# Altium schematic sheet Output.SchDoc
size A2; SPICEModelCacheAEWMZWDM: <root> / <DocumentId>AEWMZWDM</DocumentId> / </root>; SheetNumber: 8; SheetTotal: 9
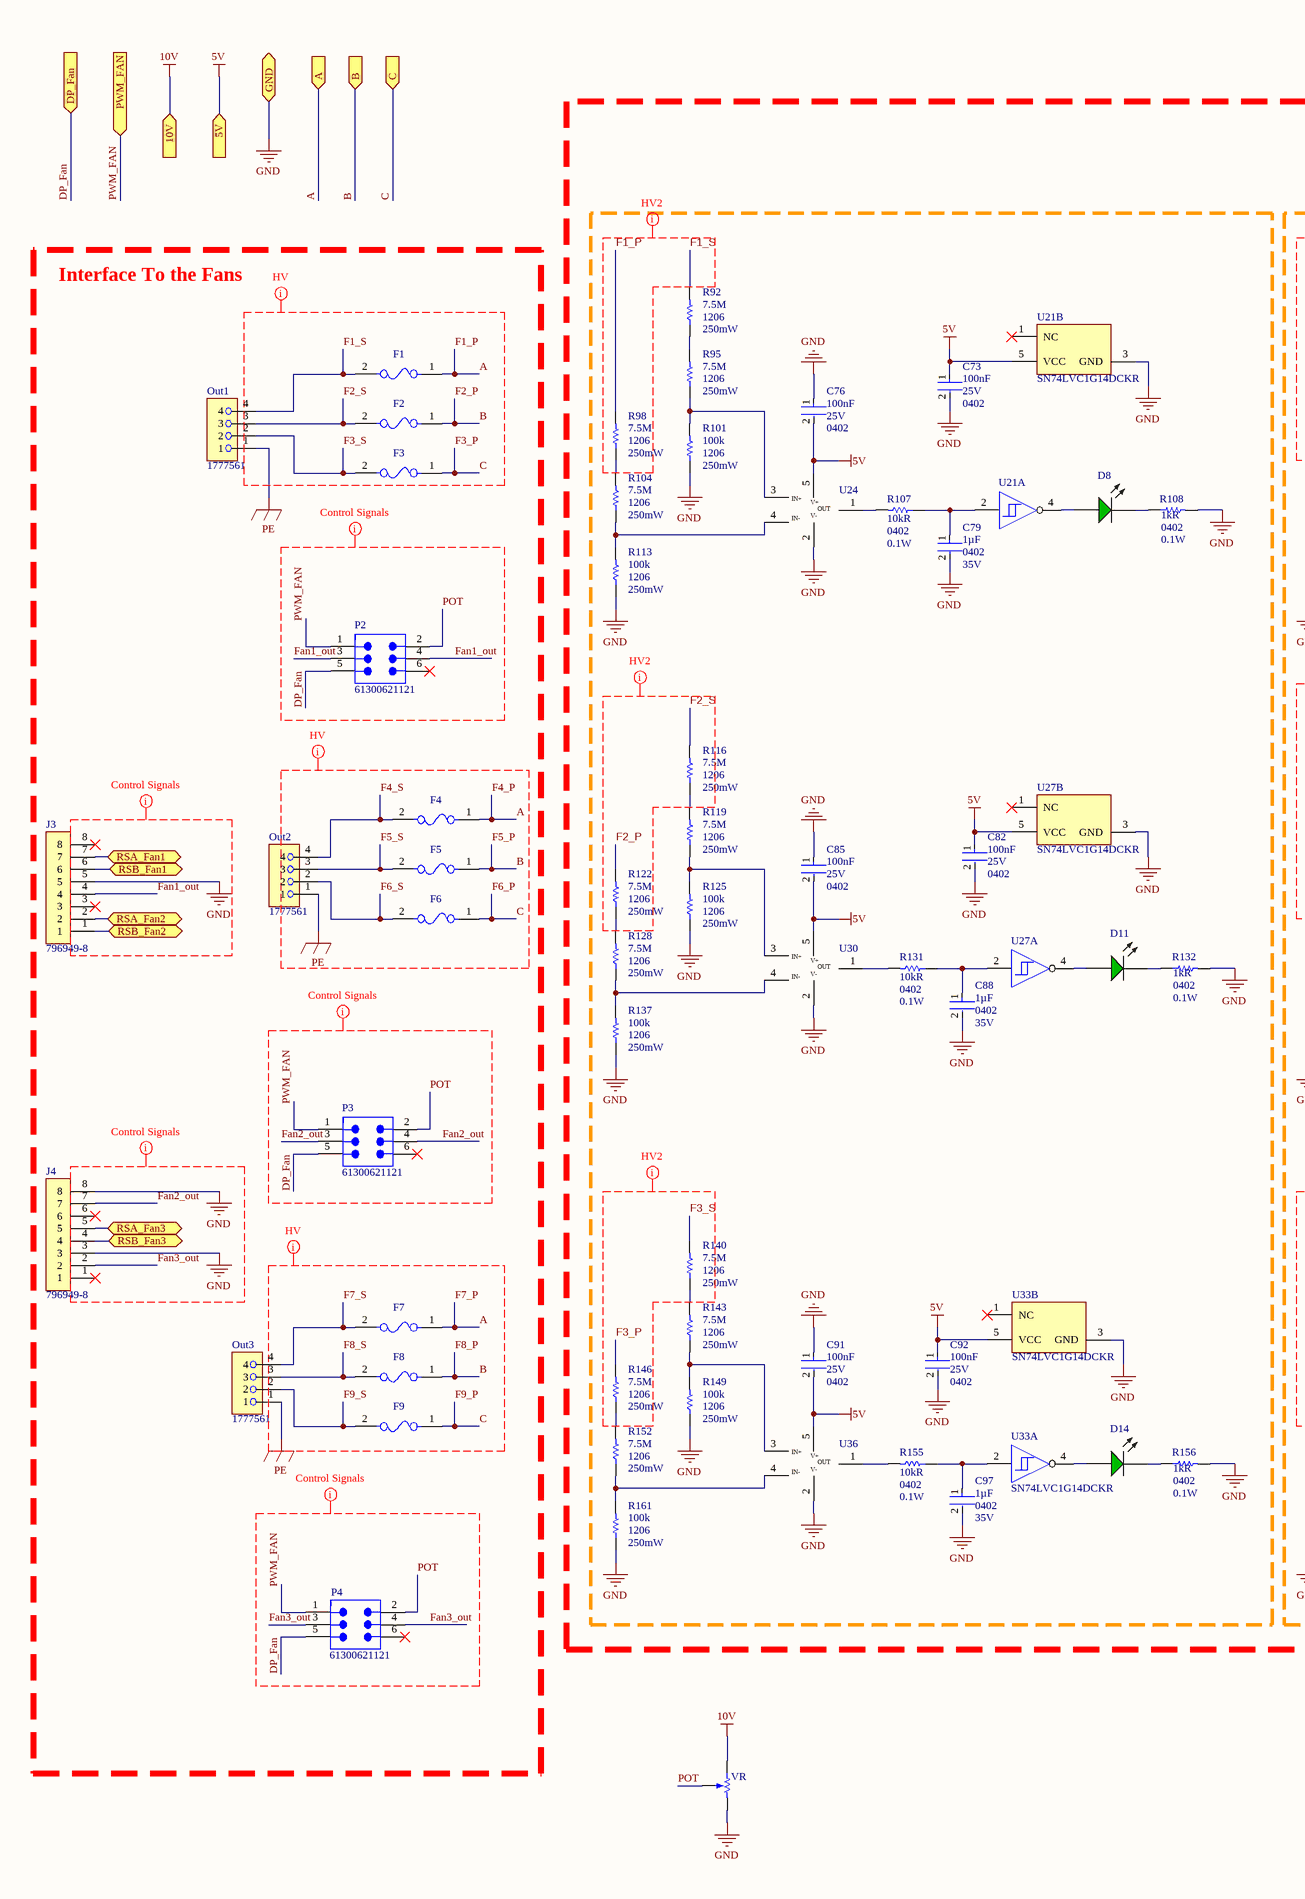
[diagram p0: Output.SchDoc, left]
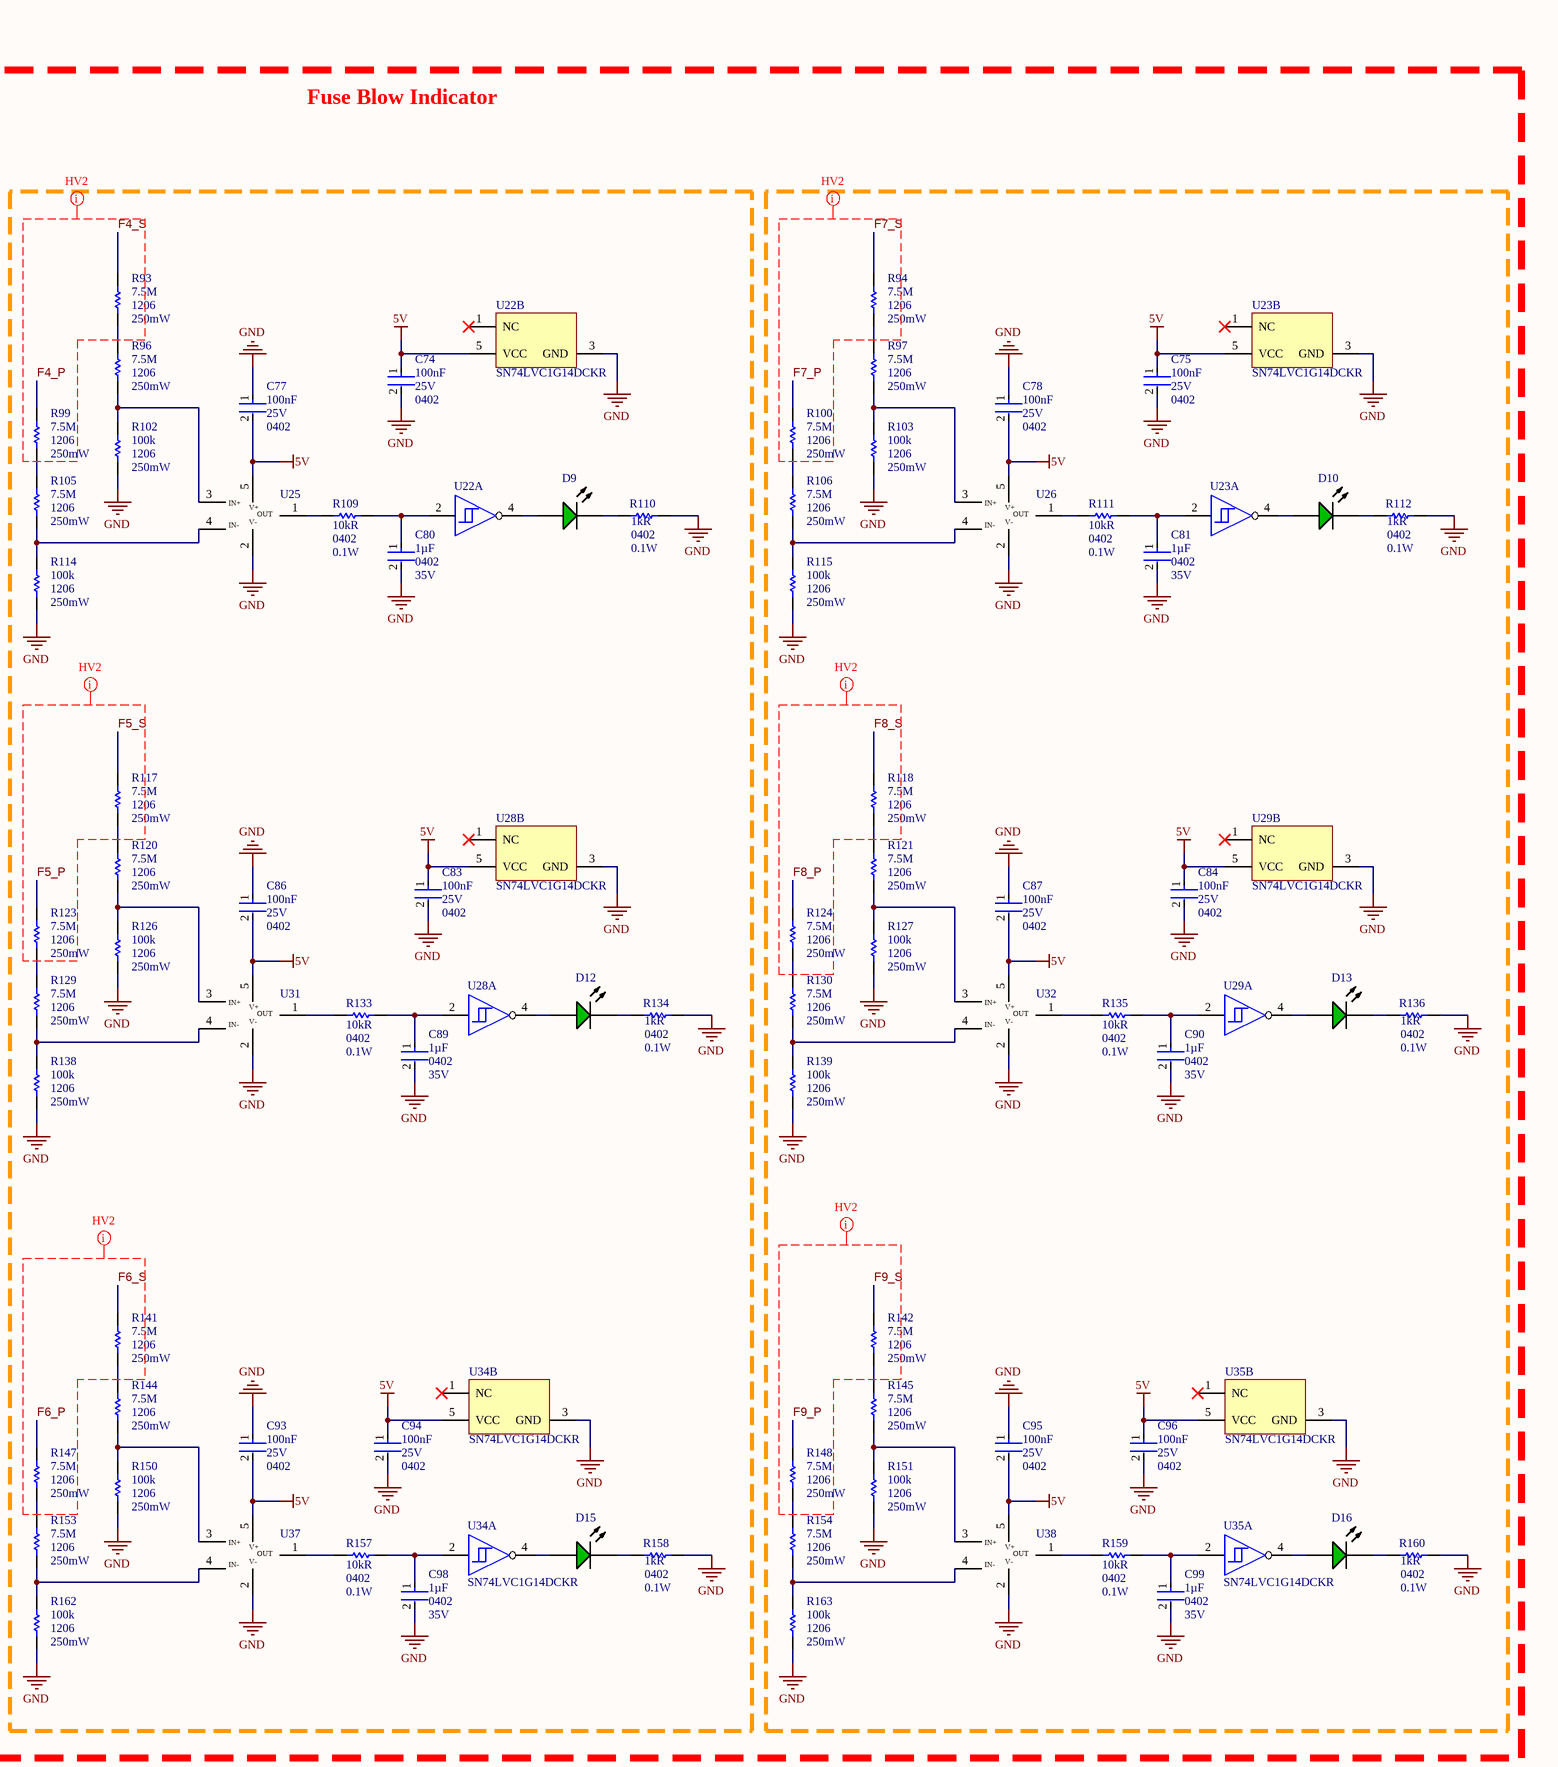
[diagram p1: Output.SchDoc, right]

## Parts
C73  value 100nF  Voltage Rating: 25V  Case/Package: 0402  [FP-CL830-IPC_A]  (hidden comment: CL05B104KA5NNNC)
C74  value 100nF  Voltage Rating: 25V  Case/Package: 0402  [FP-CL830-IPC_A]  (hidden comment: CL05B104KA5NNNC)
C75  value 100nF  Voltage Rating: 25V  Case/Package: 0402  [FP-CL830-IPC_A]  (hidden comment: CL05B104KA5NNNC)
C76  value 100nF  Voltage Rating: 25V  Case/Package: 0402  [FP-CL830-IPC_A]  (hidden comment: CL05B104KA5NNNC)
C77  value 100nF  Voltage Rating: 25V  Case/Package: 0402  [FP-CL830-IPC_A]  (hidden comment: CL05B104KA5NNNC)
C78  value 100nF  Voltage Rating: 25V  Case/Package: 0402  [FP-CL830-IPC_A]  (hidden comment: CL05B104KA5NNNC)
C79  value 1µF  Case/Package: 0402  Voltage Rating: 35V  [FP-C1005-050-0_05-IPC_A]  (hidden comment: C1005JB1V105K050BC)
C80  value 1µF  Case/Package: 0402  Voltage Rating: 35V  [FP-C1005-050-0_05-IPC_A]  (hidden comment: C1005JB1V105K050BC)
C81  value 1µF  Case/Package: 0402  Voltage Rating: 35V  [FP-C1005-050-0_05-IPC_A]  (hidden comment: C1005JB1V105K050BC)
C82  value 100nF  Voltage Rating: 25V  Case/Package: 0402  [FP-CL830-IPC_A]  (hidden comment: CL05B104KA5NNNC)
C83  value 100nF  Voltage Rating: 25V  Case/Package: 0402  [FP-CL830-IPC_A]  (hidden comment: CL05B104KA5NNNC)
C84  value 100nF  Voltage Rating: 25V  Case/Package: 0402  [FP-CL830-IPC_A]  (hidden comment: CL05B104KA5NNNC)
C85  value 100nF  Voltage Rating: 25V  Case/Package: 0402  [FP-CL830-IPC_A]  (hidden comment: CL05B104KA5NNNC)
C86  value 100nF  Voltage Rating: 25V  Case/Package: 0402  [FP-CL830-IPC_A]  (hidden comment: CL05B104KA5NNNC)
C87  value 100nF  Voltage Rating: 25V  Case/Package: 0402  [FP-CL830-IPC_A]  (hidden comment: CL05B104KA5NNNC)
C88  value 1µF  Case/Package: 0402  Voltage Rating: 35V  [FP-C1005-050-0_05-IPC_A]  (hidden comment: C1005JB1V105K050BC)
C89  value 1µF  Case/Package: 0402  Voltage Rating: 35V  [FP-C1005-050-0_05-IPC_A]  (hidden comment: C1005JB1V105K050BC)
C90  value 1µF  Case/Package: 0402  Voltage Rating: 35V  [FP-C1005-050-0_05-IPC_A]  (hidden comment: C1005JB1V105K050BC)
C91  value 100nF  Voltage Rating: 25V  Case/Package: 0402  [FP-CL830-IPC_A]  (hidden comment: CL05B104KA5NNNC)
C92  value 100nF  Voltage Rating: 25V  Case/Package: 0402  [FP-CL830-IPC_A]  (hidden comment: CL05B104KA5NNNC)
C93  value 100nF  Voltage Rating: 25V  Case/Package: 0402  [FP-CL830-IPC_A]  (hidden comment: CL05B104KA5NNNC)
C94  value 100nF  Voltage Rating: 25V  Case/Package: 0402  [FP-CL830-IPC_A]  (hidden comment: CL05B104KA5NNNC)
C95  value 100nF  Voltage Rating: 25V  Case/Package: 0402  [FP-CL830-IPC_A]  (hidden comment: CL05B104KA5NNNC)
C96  value 100nF  Voltage Rating: 25V  Case/Package: 0402  [FP-CL830-IPC_A]  (hidden comment: CL05B104KA5NNNC)
C97  value 1µF  Case/Package: 0402  Voltage Rating: 35V  [FP-C1005-050-0_05-IPC_A]  (hidden comment: C1005JB1V105K050BC)
C98  value 1µF  Case/Package: 0402  Voltage Rating: 35V  [FP-C1005-050-0_05-IPC_A]  (hidden comment: C1005JB1V105K050BC)
C99  value 1µF  Case/Package: 0402  Voltage Rating: 35V  [FP-C1005-050-0_05-IPC_A]  (hidden comment: C1005JB1V105K050BC)
D8  599-0480-127F  [QTLP650D4TR-Footprint-1]  (value not drawn)
D9  599-0480-127F  [QTLP650D4TR-Footprint-1]  (value not drawn)
D10  599-0480-127F  [QTLP650D4TR-Footprint-1]  (value not drawn)
D11  599-0480-127F  [QTLP650D4TR-Footprint-1]  (value not drawn)
D12  599-0480-127F  [QTLP650D4TR-Footprint-1]  (value not drawn)
D13  599-0480-127F  [QTLP650D4TR-Footprint-1]  (value not drawn)
D14  599-0480-127F  [QTLP650D4TR-Footprint-1]  (value not drawn)
D15  599-0480-127F  [QTLP650D4TR-Footprint-1]  (value not drawn)
D16  599-0480-127F  [QTLP650D4TR-Footprint-1]  (value not drawn)
F1  01220088ZR  [New footprint 1]  (value not drawn)
F2  01220088ZR  [New footprint 1]  (value not drawn)
F3  01220088ZR  [New footprint 1]  (value not drawn)
F4  01220088ZR  [New footprint 1]  (value not drawn)
F5  01220088ZR  [New footprint 1]  (value not drawn)
F6  01220088ZR  [New footprint 1]  (value not drawn)
F7  01220088ZR  [New footprint 1]  (value not drawn)
F8  01220088ZR  [New footprint 1]  (value not drawn)
F9  01220088ZR  [New footprint 1]  (value not drawn)
J3  796949-8  [796949-8-Footprint-1]
J4  796949-8  [796949-8-Footprint-1]
Out1  1777561  [1777561-Footprint-1]
Out2  1777561  [1777561-Footprint-1]
Out3  1777561  [1777561-Footprint-1]
P2  61300621121  [61300621121]
P3  61300621121  [61300621121]
P4  61300621121  [61300621121]
R92  value 7.5M  Case/Package: 1206  Power: 250mW  [FP-KTR18-IPC_A]  (hidden comment: KTR18EZPF7504)
R93  value 7.5M  Case/Package: 1206  Power: 250mW  [FP-KTR18-IPC_A]  (hidden comment: KTR18EZPF7504)
R94  value 7.5M  Case/Package: 1206  Power: 250mW  [FP-KTR18-IPC_A]  (hidden comment: KTR18EZPF7504)
R95  value 7.5M  Case/Package: 1206  Power: 250mW  [FP-KTR18-IPC_A]  (hidden comment: KTR18EZPF7504)
R96  value 7.5M  Case/Package: 1206  Power: 250mW  [FP-KTR18-IPC_A]  (hidden comment: KTR18EZPF7504)
R97  value 7.5M  Case/Package: 1206  Power: 250mW  [FP-KTR18-IPC_A]  (hidden comment: KTR18EZPF7504)
R98  value 7.5M  Case/Package: 1206  Power: 250mW  [FP-KTR18-IPC_A]  (hidden comment: KTR18EZPF7504)
R99  value 7.5M  Case/Package: 1206  Power: 250mW  [FP-KTR18-IPC_A]  (hidden comment: KTR18EZPF7504)
R100  value 7.5M  Case/Package: 1206  Power: 250mW  [FP-KTR18-IPC_A]  (hidden comment: KTR18EZPF7504)
R101  value 100k  Case/Package: 1206  Power: 250mW  [RESC3216X70X40NL20T20]  (hidden comment: RK73H2BTTD1003F)
R102  value 100k  Case/Package: 1206  Power: 250mW  [RESC3216X70X40NL20T20]  (hidden comment: RK73H2BTTD1003F)
R103  value 100k  Case/Package: 1206  Power: 250mW  [RESC3216X70X40NL20T20]  (hidden comment: RK73H2BTTD1003F)
R104  value 7.5M  Case/Package: 1206  Power: 250mW  [FP-KTR18-IPC_A]  (hidden comment: KTR18EZPF7504)
R105  value 7.5M  Case/Package: 1206  Power: 250mW  [FP-KTR18-IPC_A]  (hidden comment: KTR18EZPF7504)
R106  value 7.5M  Case/Package: 1206  Power: 250mW  [FP-KTR18-IPC_A]  (hidden comment: KTR18EZPF7504)
R107  value 10kR  Package: 0402  Power: 0.1W  [RESC1005X40X25LL10T10]  (hidden comment: RK73H1ETTP1002F)
R108  value 1kR  Package: 0402  Power: 0.1W  [RESC1005X40X25LL10T10]  (hidden comment: RK73H1ETTP1001F)
R109  value 10kR  Package: 0402  Power: 0.1W  [RESC1005X40X25LL10T10]  (hidden comment: RK73H1ETTP1002F)
R110  value 1kR  Package: 0402  Power: 0.1W  [RESC1005X40X25LL10T10]  (hidden comment: RK73H1ETTP1001F)
R111  value 10kR  Package: 0402  Power: 0.1W  [RESC1005X40X25LL10T10]  (hidden comment: RK73H1ETTP1002F)
R112  value 1kR  Package: 0402  Power: 0.1W  [RESC1005X40X25LL10T10]  (hidden comment: RK73H1ETTP1001F)
R113  value 100k  Case/Package: 1206  Power: 250mW  [RESC3216X70X40NL20T20]  (hidden comment: RK73H2BTTD1003F)
R114  value 100k  Case/Package: 1206  Power: 250mW  [RESC3216X70X40NL20T20]  (hidden comment: RK73H2BTTD1003F)
R115  value 100k  Case/Package: 1206  Power: 250mW  [RESC3216X70X40NL20T20]  (hidden comment: RK73H2BTTD1003F)
R116  value 7.5M  Case/Package: 1206  Power: 250mW  [FP-KTR18-IPC_A]  (hidden comment: KTR18EZPF7504)
R117  value 7.5M  Case/Package: 1206  Power: 250mW  [FP-KTR18-IPC_A]  (hidden comment: KTR18EZPF7504)
R118  value 7.5M  Case/Package: 1206  Power: 250mW  [FP-KTR18-IPC_A]  (hidden comment: KTR18EZPF7504)
R119  value 7.5M  Case/Package: 1206  Power: 250mW  [FP-KTR18-IPC_A]  (hidden comment: KTR18EZPF7504)
R120  value 7.5M  Case/Package: 1206  Power: 250mW  [FP-KTR18-IPC_A]  (hidden comment: KTR18EZPF7504)
R121  value 7.5M  Case/Package: 1206  Power: 250mW  [FP-KTR18-IPC_A]  (hidden comment: KTR18EZPF7504)
R122  value 7.5M  Case/Package: 1206  Power: 250mW  [FP-KTR18-IPC_A]  (hidden comment: KTR18EZPF7504)
R123  value 7.5M  Case/Package: 1206  Power: 250mW  [FP-KTR18-IPC_A]  (hidden comment: KTR18EZPF7504)
R124  value 7.5M  Case/Package: 1206  Power: 250mW  [FP-KTR18-IPC_A]  (hidden comment: KTR18EZPF7504)
R125  value 100k  Case/Package: 1206  Power: 250mW  [RESC3216X70X40NL20T20]  (hidden comment: RK73H2BTTD1003F)
R126  value 100k  Case/Package: 1206  Power: 250mW  [RESC3216X70X40NL20T20]  (hidden comment: RK73H2BTTD1003F)
R127  value 100k  Case/Package: 1206  Power: 250mW  [RESC3216X70X40NL20T20]  (hidden comment: RK73H2BTTD1003F)
R128  value 7.5M  Case/Package: 1206  Power: 250mW  [FP-KTR18-IPC_A]  (hidden comment: KTR18EZPF7504)
R129  value 7.5M  Case/Package: 1206  Power: 250mW  [FP-KTR18-IPC_A]  (hidden comment: KTR18EZPF7504)
R130  value 7.5M  Case/Package: 1206  Power: 250mW  [FP-KTR18-IPC_A]  (hidden comment: KTR18EZPF7504)
R131  value 10kR  Package: 0402  Power: 0.1W  [RESC1005X40X25LL10T10]  (hidden comment: RK73H1ETTP1002F)
R132  value 1kR  Package: 0402  Power: 0.1W  [RESC1005X40X25LL10T10]  (hidden comment: RK73H1ETTP1001F)
R133  value 10kR  Package: 0402  Power: 0.1W  [RESC1005X40X25LL10T10]  (hidden comment: RK73H1ETTP1002F)
R134  value 1kR  Package: 0402  Power: 0.1W  [RESC1005X40X25LL10T10]  (hidden comment: RK73H1ETTP1001F)
R135  value 10kR  Package: 0402  Power: 0.1W  [RESC1005X40X25LL10T10]  (hidden comment: RK73H1ETTP1002F)
R136  value 1kR  Package: 0402  Power: 0.1W  [RESC1005X40X25LL10T10]  (hidden comment: RK73H1ETTP1001F)
R137  value 100k  Case/Package: 1206  Power: 250mW  [RESC3216X70X40NL20T20]  (hidden comment: RK73H2BTTD1003F)
R138  value 100k  Case/Package: 1206  Power: 250mW  [RESC3216X70X40NL20T20]  (hidden comment: RK73H2BTTD1003F)
R139  value 100k  Case/Package: 1206  Power: 250mW  [RESC3216X70X40NL20T20]  (hidden comment: RK73H2BTTD1003F)
R140  value 7.5M  Case/Package: 1206  Power: 250mW  [FP-KTR18-IPC_A]  (hidden comment: KTR18EZPF7504)
R141  value 7.5M  Case/Package: 1206  Power: 250mW  [FP-KTR18-IPC_A]  (hidden comment: KTR18EZPF7504)
R142  value 7.5M  Case/Package: 1206  Power: 250mW  [FP-KTR18-IPC_A]  (hidden comment: KTR18EZPF7504)
R143  value 7.5M  Case/Package: 1206  Power: 250mW  [FP-KTR18-IPC_A]  (hidden comment: KTR18EZPF7504)
R144  value 7.5M  Case/Package: 1206  Power: 250mW  [FP-KTR18-IPC_A]  (hidden comment: KTR18EZPF7504)
R145  value 7.5M  Case/Package: 1206  Power: 250mW  [FP-KTR18-IPC_A]  (hidden comment: KTR18EZPF7504)
R146  value 7.5M  Case/Package: 1206  Power: 250mW  [FP-KTR18-IPC_A]  (hidden comment: KTR18EZPF7504)
R147  value 7.5M  Case/Package: 1206  Power: 250mW  [FP-KTR18-IPC_A]  (hidden comment: KTR18EZPF7504)
R148  value 7.5M  Case/Package: 1206  Power: 250mW  [FP-KTR18-IPC_A]  (hidden comment: KTR18EZPF7504)
R149  value 100k  Case/Package: 1206  Power: 250mW  [RESC3216X70X40NL20T20]  (hidden comment: RK73H2BTTD1003F)
R150  value 100k  Case/Package: 1206  Power: 250mW  [RESC3216X70X40NL20T20]  (hidden comment: RK73H2BTTD1003F)
R151  value 100k  Case/Package: 1206  Power: 250mW  [RESC3216X70X40NL20T20]  (hidden comment: RK73H2BTTD1003F)
R152  value 7.5M  Case/Package: 1206  Power: 250mW  [FP-KTR18-IPC_A]  (hidden comment: KTR18EZPF7504)
R153  value 7.5M  Case/Package: 1206  Power: 250mW  [FP-KTR18-IPC_A]  (hidden comment: KTR18EZPF7504)
R154  value 7.5M  Case/Package: 1206  Power: 250mW  [FP-KTR18-IPC_A]  (hidden comment: KTR18EZPF7504)
R155  value 10kR  Package: 0402  Power: 0.1W  [RESC1005X40X25LL10T10]  (hidden comment: RK73H1ETTP1002F)
R156  value 1kR  Package: 0402  Power: 0.1W  [RESC1005X40X25LL10T10]  (hidden comment: RK73H1ETTP1001F)
R157  value 10kR  Package: 0402  Power: 0.1W  [RESC1005X40X25LL10T10]  (hidden comment: RK73H1ETTP1002F)
R158  value 1kR  Package: 0402  Power: 0.1W  [RESC1005X40X25LL10T10]  (hidden comment: RK73H1ETTP1001F)
R159  value 10kR  Package: 0402  Power: 0.1W  [RESC1005X40X25LL10T10]  (hidden comment: RK73H1ETTP1002F)
R160  value 1kR  Package: 0402  Power: 0.1W  [RESC1005X40X25LL10T10]  (hidden comment: RK73H1ETTP1001F)
R161  value 100k  Case/Package: 1206  Power: 250mW  [RESC3216X70X40NL20T20]  (hidden comment: RK73H2BTTD1003F)
R162  value 100k  Case/Package: 1206  Power: 250mW  [RESC3216X70X40NL20T20]  (hidden comment: RK73H2BTTD1003F)
R163  value 100k  Case/Package: 1206  Power: 250mW  [RESC3216X70X40NL20T20]  (hidden comment: RK73H2BTTD1003F)
U21  SN74LVC1G14DCKR  [DCK0005A_N]  (value not drawn)  (parts A,B of 2)
U22  SN74LVC1G14DCKR  [DCK0005A_N]  (value not drawn)  (parts A,B of 2)
U23  SN74LVC1G14DCKR  [DCK0005A_N]  (value not drawn)  (parts A,B of 2)
U24  TLV6001UIDBVR  [TLV6001UIDBVR-Footprint-1]  (value not drawn)
U25  TLV6001UIDBVR  [TLV6001UIDBVR-Footprint-1]  (value not drawn)
U26  TLV6001UIDBVR  [TLV6001UIDBVR-Footprint-1]  (value not drawn)
U27  SN74LVC1G14DCKR  [DCK0005A_N]  (value not drawn)  (parts A,B of 2)
U28  SN74LVC1G14DCKR  [DCK0005A_N]  (value not drawn)  (parts A,B of 2)
U29  SN74LVC1G14DCKR  [DCK0005A_N]  (value not drawn)  (parts A,B of 2)
U30  TLV6001UIDBVR  [TLV6001UIDBVR-Footprint-1]  (value not drawn)
U31  TLV6001UIDBVR  [TLV6001UIDBVR-Footprint-1]  (value not drawn)
U32  TLV6001UIDBVR  [TLV6001UIDBVR-Footprint-1]  (value not drawn)
U33  SN74LVC1G14DCKR  [DCK0005A_N]  (parts A,B of 2)
U34  SN74LVC1G14DCKR  [DCK0005A_N]  (parts A,B of 2)
U35  SN74LVC1G14DCKR  [DCK0005A_N]  (parts A,B of 2)
U36  TLV6001UIDBVR  [TLV6001UIDBVR-Footprint-1]  (value not drawn)
U37  TLV6001UIDBVR  [TLV6001UIDBVR-Footprint-1]  (value not drawn)
U38  TLV6001UIDBVR  [TLV6001UIDBVR-Footprint-1]  (value not drawn)
VR  PC16SV-10IP06-103A2020-TA  [PC16SV-10IP06-103A2020-TA-Footprint-1]  (value not drawn)

## Blocks framed on the sheet
Fuse Blow Indicator: C73-C99 D8-D16 R92-R163 U21-U38
Interface To the Fans: F1-F9 J3 J4 Out1-Out3 P2-P4

## Ports
5V (in), 10V (in), A (in), B (in), C (in), DP_Fan (in), GND (bidir), PWM_FAN (in), RSA_Fan1 (bidir), RSA_Fan2 (bidir), RSA_Fan3 (bidir), RSB_Fan1 (bidir), RSB_Fan2 (bidir), RSB_Fan3 (bidir)

## Nets
5V: C73.1 C74.1 C75.1 C76.2 C77.2 C78.2 C82.1 C83.1 C84.1 C85.2 C86.2 C87.2 C91.2 C92.1 C93.2 C94.1 C95.2 C96.1 U21.5(VCC) U22.5(VCC) U23.5(VCC) U24.5(V+) U25.5(V+) U26.5(V+) U27.5(VCC) U28.5(VCC) U29.5(VCC) U30.5(V+) U31.5(V+) U32.5(V+) U33.5(VCC) U34.5(VCC) U35.5(VCC) U36.5(V+) U37.5(V+) U38.5(V+) ; port 5V
10V: VR.1 ; port 10V
GND: C73.2 C74.2 C75.2 C76.1 C77.1 C78.1 C79.2 C80.2 C81.2 C82.2 C83.2 C84.2 C85.1 C86.1 C87.1 C88.2 C89.2 C90.2 C91.1 C92.2 C93.1 C94.2 C95.1 C96.2 C97.2 C98.2 C99.2 J3.5 J4.3 J4.8 R101.1 R102.1 R103.1 R108.2 R110.2 R112.2 R113.1 R114.1 R115.1 R125.1 R126.1 R127.1 R132.2 R134.2 R136.2 R137.1 R138.1 R139.1 R149.1 R150.1 R151.1 R156.2 R158.2 R160.2 R161.1 R162.1 R163.1 U21.3(GND) U22.3(GND) U23.3(GND) U24.2(V-) U25.2(V-) U26.2(V-) U27.3(GND) U28.3(GND) U29.3(GND) U30.2(V-) U31.2(V-) U32.2(V-) U33.3(GND) U34.3(GND) U35.3(GND) U36.2(V-) U37.2(V-) U38.2(V-) VR.3 ; port GND
PE: Out1.1 Out2.1 Out3.1
A: F1.1 F4.1 F7.1 R98.2 R99.2 R100.2 ; port A  [also labelled F1_P, F4_P, F7_P]
B: F2.1 F5.1 F8.1 R122.2 R123.2 R124.2 ; port B  [also labelled F2_P, F5_P, F8_P]
C: F3.1 F6.1 F9.1 R146.2 R147.2 R148.2 ; port C  [also labelled F3_P, F6_P, F9_P]
DP_Fan: P2.5 P3.5 P4.5 ; port DP_Fan
F1_S: F1.2 Out1.4 R92.2
F2_S: F2.2 Out1.3 R116.2
F3_S: F3.2 Out1.2 R140.2
F4_S: F4.2 Out2.4 R93.2
F5_S: F5.2 Out2.3 R117.2
F6_S: F6.2 Out2.2 R141.2
F7_S: F7.2 Out3.4 R94.2
F8_S: F8.2 Out3.3 R118.2
F9_S: F9.2 Out3.2 R142.2
Fan1_out: J3.4 P2.3 P2.4
Fan2_out: J4.7 P3.3 P3.4
Fan3_out: J4.2 P4.3 P4.4
POT: P2.2 P3.2 P4.2 VR.2
PWM_FAN: P2.1 P3.1 P4.1 ; port PWM_FAN
RSA_Fan1: J3.7 ; port RSA_Fan1
RSA_Fan2: J3.2 ; port RSA_Fan2
RSA_Fan3: J4.5 ; port RSA_Fan3
RSB_Fan1: J3.6 ; port RSB_Fan1
RSB_Fan2: J3.1 ; port RSB_Fan2
RSB_Fan3: J4.4 ; port RSB_Fan3
NetC79_1: C79.1 R107.1 U21.2(A)
NetC80_1: C80.1 R109.1 U22.2(A)
NetC81_1: C81.1 R111.1 U23.2(A)
NetC88_1: C88.1 R131.1 U27.2(A)
NetC89_1: C89.1 R133.1 U28.2(A)
NetC90_1: C90.1 R135.1 U29.2(A)
NetC97_1: C97.1 R155.1 U33.2(A)
NetC98_1: C98.1 R157.1 U34.2(A)
NetC99_1: C99.1 R159.1 U35.2(A)
NetD8_1: D8.1(A) U21.4(Y)
NetD8_2: D8.2(K) R108.1
NetD9_1: D9.1(A) U22.4(Y)
NetD9_2: D9.2(K) R110.1
NetD10_1: D10.1(A) U23.4(Y)
NetD10_2: D10.2(K) R112.1
NetD11_1: D11.1(A) U27.4(Y)
NetD11_2: D11.2(K) R132.1
NetD12_1: D12.1(A) U28.4(Y)
NetD12_2: D12.2(K) R134.1
NetD13_1: D13.1(A) U29.4(Y)
NetD13_2: D13.2(K) R136.1
NetD14_1: D14.1(A) U33.4(Y)
NetD14_2: D14.2(K) R156.1
NetD15_1: D15.1(A) U34.4(Y)
NetD15_2: D15.2(K) R158.1
NetD16_1: D16.1(A) U35.4(Y)
NetD16_2: D16.2(K) R160.1
NetR92_1: R92.1 R95.2
NetR93_1: R93.1 R96.2
NetR94_1: R94.1 R97.2
NetR95_1: R95.1 R101.2 U24.3(+IN)
NetR96_1: R96.1 R102.2 U25.3(+IN)
NetR97_1: R97.1 R103.2 U26.3(+IN)
NetR98_1: R98.1 R104.2
NetR99_1: R99.1 R105.2
NetR100_1: R100.1 R106.2
NetR104_1: R104.1 R113.2 U24.4(-IN)
NetR105_1: R105.1 R114.2 U25.4(-IN)
NetR106_1: R106.1 R115.2 U26.4(-IN)
NetR107_2: R107.2 U24.1(OUT)
NetR109_2: R109.2 U25.1(OUT)
NetR111_2: R111.2 U26.1(OUT)
NetR116_1: R116.1 R119.2
NetR117_1: R117.1 R120.2
NetR118_1: R118.1 R121.2
NetR119_1: R119.1 R125.2 U30.3(+IN)
NetR120_1: R120.1 R126.2 U31.3(+IN)
NetR121_1: R121.1 R127.2 U32.3(+IN)
NetR122_1: R122.1 R128.2
NetR123_1: R123.1 R129.2
NetR124_1: R124.1 R130.2
NetR128_1: R128.1 R137.2 U30.4(-IN)
NetR129_1: R129.1 R138.2 U31.4(-IN)
NetR130_1: R130.1 R139.2 U32.4(-IN)
NetR131_2: R131.2 U30.1(OUT)
NetR133_2: R133.2 U31.1(OUT)
NetR135_2: R135.2 U32.1(OUT)
NetR140_1: R140.1 R143.2
NetR141_1: R141.1 R144.2
NetR142_1: R142.1 R145.2
NetR143_1: R143.1 R149.2 U36.3(+IN)
NetR144_1: R144.1 R150.2 U37.3(+IN)
NetR145_1: R145.1 R151.2 U38.3(+IN)
NetR146_1: R146.1 R152.2
NetR147_1: R147.1 R153.2
NetR148_1: R148.1 R154.2
NetR152_1: R152.1 R161.2 U36.4(-IN)
NetR153_1: R153.1 R162.2 U37.4(-IN)
NetR154_1: R154.1 R163.2 U38.4(-IN)
NetR155_2: R155.2 U36.1(OUT)
NetR157_2: R157.2 U37.1(OUT)
NetR159_2: R159.2 U38.1(OUT)

Not connected (* = marked no-connect by the designer): J3 3* 8*; J4 1* 6*; P2 6*; P3 6*; P4 6*; U21 1(NC)*; U22 1(NC)*; U23 1(NC)*; U27 1(NC)*; U28 1(NC)*; U29 1(NC)*; U33 1(NC)*; U34 1(NC)*; U35 1(NC)*

## Layout directives
net class Control Signals: DP_Fan, Fan1_out, Fan2_out, Fan3_out, GND, POT, PWM_FAN
net class HV: A, B, C, F1_P, F1_S, F2_P, F2_S, F3_P, F3_S, F4_P, F4_S, F5_P, F5_S, F6_P, F6_S, F7_P, F7_S, F8_P, F8_S, F9_P, F9_S, PE
net class HV2: F1_P, F1_S, F2_P, F2_S, F3_P, F3_S, F4_P, F4_S, F5_P, F5_S, F6_P, F6_S, F7_P, F7_S, F8_P, F8_S, F9_P, F9_S

## Notes on the sheet
- Title:
- Date:
- Drawn By:
- File:
- Time:
- Checked By:
- Sheet
- of
- (in symbol CMP-014-00008-4) IN+; IN-

## Library data of the parts
C73-C78 C82-C87 C91-C96 = CMP-001-00333-1: Ceramic Capacitor, Multilayer, Ceramic, 25V, 10% +Tol, 10% -Tol, X7R, 15% TC, 0.1uF, Surface Mount, 0402; Max Operating Temperature: 125°C; RoHS Compliant: Yes; Capacitor Type: Ceramic; Min Operating Temperature: -55°C; Pins: 2; Mounting Technology: Surface Mount
C79-C81 C88-C90 C97-C99 = CMP-001-00329-1: Ceramic Capacitor, Multilayer, Ceramic, 35V, 10% +Tol, 10% -Tol, JB, 10% TC, 1uF, Surface Mount, 0402; Capacitor Type: Ceramic; Min Operating Temperature: -25°C; RoHS Compliant: Yes; Max Operating Temperature: 85°C; Pins: 2; Mounting Technology: Surface Mount
D8-D16 = CMP-007-00044-2: Single Color LEDs 1206 w/LENS TRUE GREEN 525nm; Value: Green, 2.1V 1206 (3216 Metric)
F1-F9 = CMP-002-00085-5: 250VAC 30A 10KA
J3 J4 = CMP-002-01212-1: Fixed Terminal Blocks 8 POS TERMI-BLOK PCB MOUNT; Voltage Rating: 250V; Mounting Technology: Cable; RoHS Compliant: Yes
Out1-Out3 = CMP-002-01216-2: 4 Position Wire to Board Terminal Block Horizontal with Board 0.250" (6.35mm) Through Hole; Voltage Rating: 1kV; Max Current Rating: 30A; Mounting Technology: Board; RoHS Compliant: Yes
P2-P4 = CMP-002-00286-1: WR-PHD Pin Header, THT, Vertical, pitch 2.54mm, 2 Row, 6P; Manufacturer: Wurth Elektronik; Contact Resistance: 20mOhm; Rated Current: 3A; Withstanding Voltage: 500V; Working Voltage: 250V; ComponentLink1Description: Website Link; Category: Board-to-Board Connectors; Operating Temperature Min: -40°C; Pin Count: 6; Orientation: Vertical; Pins: 6; Source: WR-PHD.SchLib; Component Type: Standard; ComponentLink2Description: Datasheet Link; Match Code: WR-PHD; Design Item ID: 61300621121; Manufacturer Part Number: 61300621121; ComponentLink2URL: https://www.we-online.com/redexpert/spec/61300621121?ad; Operating Temperature Max: 105°C; Pitch: 2.54mm; Gender: Pin Header; ComponentLink1URL: https://www.we-online.com/redexpert/article/61300621121?ad; Packaging: Bag; Mount: Through Hole; Number of Rows: 2
R92-R100 R104-R106 R116-R124 R128-R130 R140-R148 R152-R154 = CMP-009-01037-1: Fixed Resistor, 0.25W, 7500000ohm, 500V, 1% +/-Tol, 100ppm/Cel, Surface Mount, 1206; Voltage Rating: 500V; Min Operating Temperature: -55°C; Max Operating Temperature: 155°C; RoHS Compliant: Yes; Pins: 2; Mounting Technology: Surface Mount; Tolerance: 1%
R101-R103 R113-R115 R125-R127 R137-R139 R149-R151 R161-R163 = CMP-009-00972-1: Fixed Resistor, Metal Glaze/thick Film, 0.25W, 100000ohm, 200V, 1% +/-Tol, 100ppm/Cel, Surface Mount, 1206; Tolerance: 1%; Max Operating Temperature: 155°C; Pins: 2; Min Operating Temperature: -55°C; RoHS Compliant: Yes; Mounting Technology: Surface Mount
R107 R109 R111 R131 R133 R135 R155 R157 R159 = CMP-x00150-2: Fixed Resistor, Metal Glaze/thick Film, 0.1W, 10000ohm, 75V, 1% +/-Tol, 100ppm/Cel, Surface Mount, 0402; Template: KS_0402_R
R108 R110 R112 R132 R134 R136 R156 R158 R160 = CMP-x00163-2: Fixed Resistor, Metal Glaze/thick Film, 0.1W, 1000ohm, 75V, 1% +/-Tol, 100ppm/Cel, Surface Mount, 0402; Manufacturer: KOA Speer; Template: KS_0402_R; Category: Resistors
U21-U23 U27-U29 U33-U35 = CMP-00114-2: Inverter, LVC/LCX/Z Series, 1-Func, 1-Input, CMOS, PDSO5
U24-U26 U30-U32 U36-U38 = CMP-014-00008-4: Operational Amplifiers - Op Amps 1-Channel, 1-MHz, low power op amp for cost-sensitive systems 5-SOT-23 -40 to 125; Template: TI_SOT_23_5
VR = CMP-009-01039-2: 10k Ohm 1 Gang Linear Panel Mount Potentiometer 1.0 Turns Carbon 0.2W, 1/5W PC Pins